# Altium schematic sheet RPL_TEMP.SchDoc: Tempereture Sensor Driver -200 to 300 C
size A; Date: Dec 27, 2017; DrawnBy: Seyed Omid Hasanli; Revision: 2.0; SheetNumber: 5
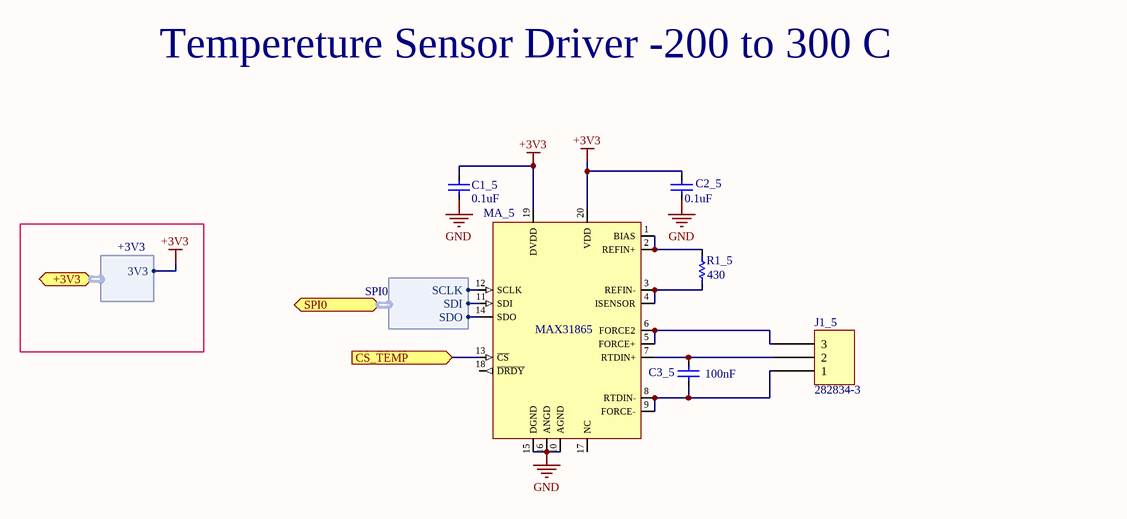
[diagram p0: RPL_TEMP.SchDoc]

## Parts
C1_5  value 0.1uF  [C0805C475K9RACAUTO]  (hidden comment: Cap)
C2_5  value 0.1uF  [C0805C475K9RACAUTO]  (hidden comment: Cap)
C3_5  value 100nF  [C0805C475K9RACAUTO]  (hidden comment: Cap)
J1_5  282834-3  [TE 282834-3]
MA_5  MAX31865  [TQFN20-EP-Maxim]
R1_5  value 430  [RES 0805]  (hidden comment: Res)

## Ports
+3V3 (harness +3V3), CS_TEMP (in), SPI0 (harness SPI0)

## Harnesses
SPI0: SCLK, SDI, SDO
+3V3: 3V3

## Nets
+3V3: C1_5.2 C2_5.2 MA_5.19(DVDD) MA_5.20(VDD) ; port +3V3.3V3
GND: C1_5.1 C2_5.1 MA_5.10(AGND) MA_5.15(DGND) MA_5.16(ANGD)
CS_TEMP: MA_5.13(~{CS}) ; port CS_TEMP
NetC3_5_1: C3_5.1 J1_5.1 MA_5.8(RTDIN-) MA_5.9(FORCE-)
NetC3_5_2: C3_5.2 J1_5.2 MA_5.7(RTDIN+)
NetJ1_5_3: J1_5.3 MA_5.5(FORCE+) MA_5.6(FORCE2)
NetMA_5_1: MA_5.1(BIAS) MA_5.2(REFIN+) R1_5.2
NetMA_5_3: MA_5.3(REFIN-) MA_5.4(ISENSOR) R1_5.1
NetMA_5_11: MA_5.11(SDI) ; port SPI0.SDI
NetMA_5_12: MA_5.12(SCLK) ; port SPI0.SCLK
NetMA_5_14: MA_5.14(SDO) ; port SPI0.SDO

Not connected (* = marked no-connect by the designer): MA_5 17(NC) 18(~{DRDY})

## Notes on the sheet
- Tempereture Sensor Driver -200 to 300 C
- Title:
- DrawnBy:
- Revision:
- SheetNumber:
- Date:
- Datasheet Link:

## Library data of the parts
J1_5 = 282834-3: TERM BLOCK 3POS SIDE ENT 2.54MM; Manufacturer: TE Connectivity AMP Connectors; TemperatureRange: -40C ~ 105C; Voltage: 150V; Pitch: 0.100" (2.54mm); Number Of Levels: 1; Positions Per Level: 3; Part Number: 282834-3; PartId: 9290; Supplier 1: Digi-Key; Supplier Part Number 1: A98334-ND; ComponentLink1Description: Datasheet; ComponentLink1URL: http://www.te.com/commerce/DocumentDelivery/DDEController?Action=srchrtrv&DocNm=282834&DocType=Customer+Drawing&DocLang=English; ComponentLink2Description: Digi-Key Listing; ComponentLink2URL: http://www.digikey.ca/product-detail/en/282834-3/A98334-ND/1153264; Price: 2.25; Colour: Green; Orientation: Horizontal with Board
MA_5 = MAX31865: Link: *